# EAGLE design usb (EAGLE 7.7.0)
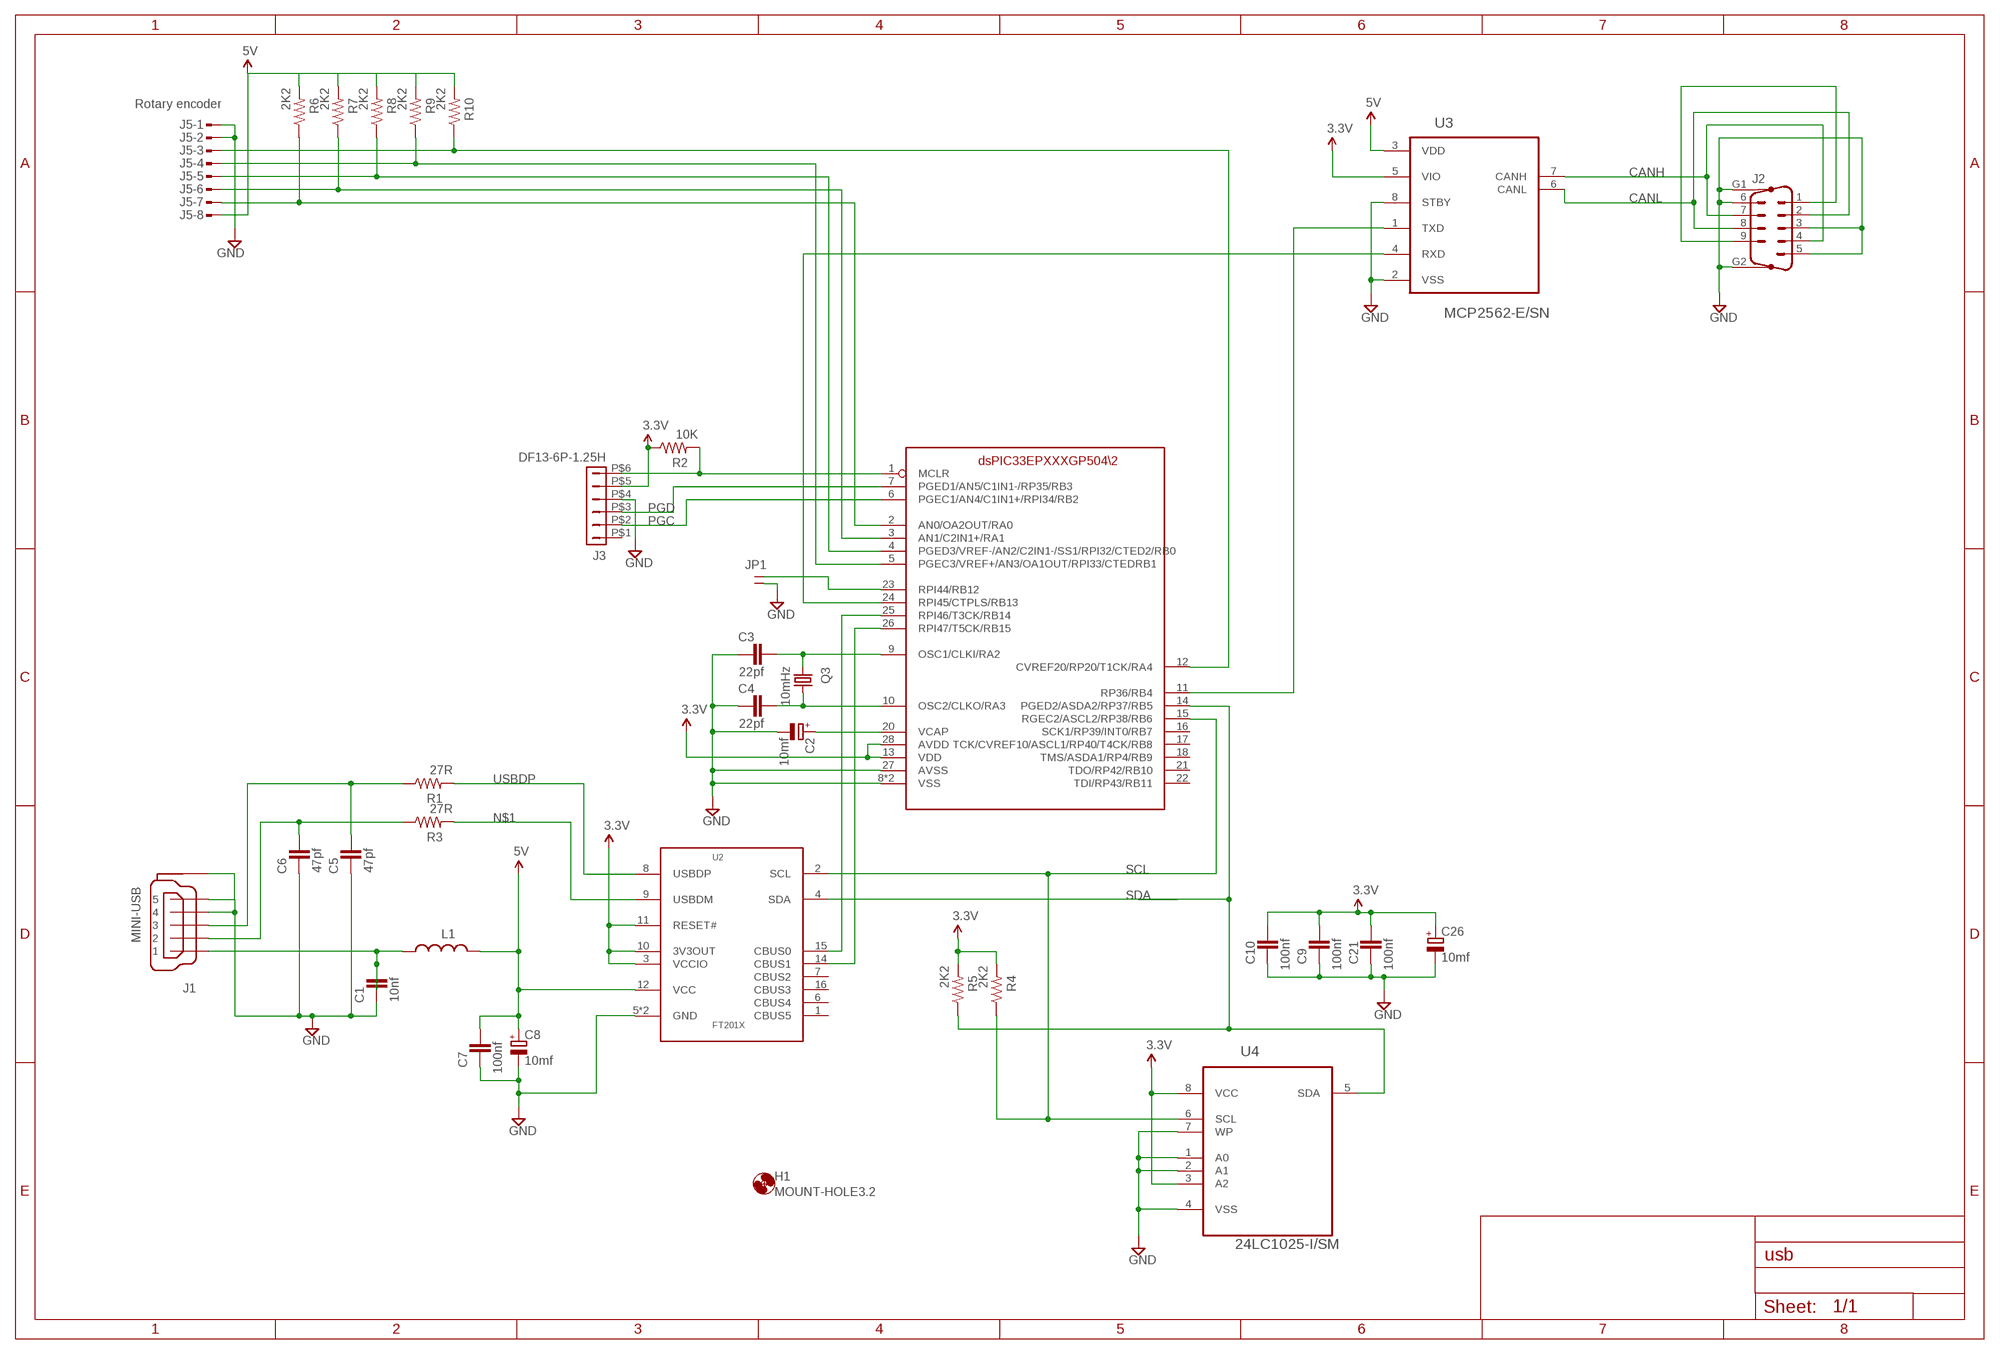
[diagram p0: schematic, sheet 1]

## Parts
C1  10nf  CAPACITOR_NPOL-0805  [C805]
C2  10mf  CAPACITOR_POL-SMC_A  [SMC_A]
C3  22pf  CAPACITOR_NPOL-0805  [C805]
C4  22pf  CAPACITOR_NPOL-0805  [C805]
C5  47pf  CAPACITOR_NPOL-0805  [C805]
C6  47pf  CAPACITOR_NPOL-0805  [C805]
C7  100nf  CAPACITOR_NPOL-0805  [C805]
C8  10mf  CAPACITOR_POL-SMC_A  [SMC_A]
C9  100nf  CAPACITOR_NPOL-0805  [C805]
C10  100nf  CAPACITOR_NPOL-0805  [C805]
C21  100nf  CAPACITOR_NPOL-0805  [C805]
C26  10mf  CAPACITOR_POL-SMC_A  [SMC_A]
H1  MOUNT-HOLE3.2  [3,2]
J1  MINI-USB  [MINI-USB]
J2  M09HP  [M09HP]
J3  DF13-6P-1.25H  [DF13A-6P-1.25H]
J5  MTOP-8  [MTOP-8]
JP1  JUMPER-1X2  [JUMPER-1X2]
L1  FERRITE-0603  [FB603]
Q3  10mHz  CRYSTALHC49S  [HC49/S]
R1  27R  RESISTOR0603-RES  [0603-RES]
R2  10K  RESISTOR0603-RES  [0603-RES]
R3  27R  RESISTOR0603-RES  [0603-RES]
R4  2K2  RESISTOR0603-RES  [0603-RES]
R5  2K2  RESISTOR0603-RES  [0603-RES]
R6  2K2  RESISTOR0603-RES  [0603-RES]
R7  2K2  RESISTOR0603-RES  [0603-RES]
R8  2K2  RESISTOR0603-RES  [0603-RES]
R9  2K2  RESISTOR0603-RES  [0603-RES]
R10  2K2  RESISTOR0603-RES  [0603-RES]
U1  DSPIC33EPXXXGP502  [SOIC-28]
U2  FT201X  [TSSOP-16]
U3  MCP2562-E/SN  [SOIC-8N]
U4  24LC1025-I/SM  [SOIC8-N_MC]

## Nets
3.3V: C9.1 C10.1 C21.1 C26.+ J3.P$5 R2.1 R4.2 R5.2 U1.13(VDD) U1.28(AVDD) U2.3(VCCIO) U2.10(3V3OUT) U2.11(RESET#) U3.5(VIO) U4.3(A2) U4.8(VCC)
5V: C7.1 C8.+ J5.8 L1.2 R6.2 R7.2 R8.2 R9.2 R10.2 U2.12(VCC) U3.3(VDD)
!MCLR: J3.P$6 R2.2 U1.1(MCLR)
+12V: J2.1 J2.9
A+: J5.7 R6.1 U1.2(AN0/OA2OUT/RA0)
A-: J5.6 R7.1 U1.3(AN1/C2IN1+/RA1)
B+: J5.5 R8.1 U1.4(PGED3/VREF-/AN2/C2IN1-/SS1/RPI32/CTED2/RB0)
B-: J5.4 R9.1 U1.5(PGEC3/VREF+/AN3/OA1OUT/RPI33/CTEDRB1)
CANH: J2.4 J2.7 U3.7(CANH)
CANL: J2.2 J2.8 U3.6(CANL)
GND: C1.2 C2.- C3.2 C4.2 C5.2 C6.2 C7.2 C8.- C9.2 C10.2 C21.2 C26.- J1.4 J1.5 J1.M1(MOUNT) J1.M2(MOUNT) J1.M3(MOUNT) J1.M4(MOUNT) J2.3 J2.5 J2.6 J2.G1 J2.G2 J3.P$4 J5.1 J5.2 JP1.2 U1.8(VSS) U1.19(VSS) U1.27(AVSS) U2.5(GND) U2.13(GND) U3.2(VSS) U3.8(STBY) U4.1(A0) U4.2(A1) U4.4(VSS) U4.7(WP)
N$1: R3.2 U2.9(USBDM)
N$2: U1.25(RPI46/T3CK/RB14) U2.15(CBUS0)
N$3: U1.24(RPI45/CTPLS/RB13) U3.4(RXD)
N$4: C2.+ U1.20(VCAP)
N$5: C3.1 Q3.2 U1.9(OSC1/CLKI/RA2)
N$6: U1.11(RP36/RB4) U3.1(TXD)
N$7: U1.26(RPI47/T5CK/RB15) U2.14(CBUS1)
N$9: C6.1 J1.2 R3.1
N$10: C1.1 J1.1 L1.1
N$14: C5.1 J1.3 R1.1
N$25: JP1.1 U1.23(RPI44/RB12)
N$70: C4.1 Q3.1 U1.10(OSC2/CLKO/RA3)
PGC: J3.P$2 U1.6(PGEC1/AN4/C1IN1+/RPI34/RB2)
PGD: J3.P$3 U1.7(PGED1/AN5/C1IN1-/RP35/RB3)
SCL: R4.1 U1.15(RGEC2/ASCL2/RP38/RB6) U2.2(SCL) U4.6(SCL)
SDA: R5.1 U1.14(PGED2/ASDA2/RP37/RB5) U2.4(SDA) U4.5(SDA)
SW1: J5.3 R10.1 U1.12(CVREF20/RP20/T1CK/RA4)
USBDP: R1.2 U2.8(USBDP)
Unconnected: J3.P$1 U1.16(SCK1/RP39/INT0/RB7) U1.17(TCK/CVREF10/ASCL1/RP40/T4CK/RB8) U1.18(TMS/ASDA1/RP4/RB9) U1.21(TDO/RP42/RB10) U1.22(TDI/RP43/RB11) U2.1(CBUS5) U2.6(CBUS4) U2.7(CBUS2) U2.16(CBUS3)

## Notes on the sheet
- Rotary encoder

## Library data of the parts
C1 C3-C7 C9 C10 C21 = dp_devices:CAPACITOR_NPOL: Non-Polarized capacitor in various packages
C2 C8 C26 = dp_devices:CAPACITOR_POL: Polarized capacitor in various packages
H1 = holes:MOUNT-HOLE: MOUNTING HOLE with drill center marker
J1 = kotuku:MINI-USB
J2 = con-subd:M09HP: SUB-D; OC_FARNELL: unknown; OC_NEWARK: unknown
J3 = con-hirose-df13:DF13-6P-1.25: DF13-6P 1.25mm Pitch Miniature Crimping Connector.
J5 = con-amp:MTOP-8: AMP connector; PARTNO: 7-215079-8
JP1 = QuantumOptics:JUMPER-1X2: Jumper, header, SIP on 0.1" grid, for option selection.
L1 = kotuku:FERRITE: Ferrite bead in various packages
Q3 = crystal:CRYSTAL: CRYSTAL; OC_FARNELL: 1667008; OC_NEWARK: unknown; PARTNO: 9B-10.000MBBK-B
R1-R5 = SparkFun-Passives:RESISTOR: Resistor Basic schematic elements and footprints for 0603, 1206, and PTH resistors.; PARTNO: ERJ-3GEYJ103V
R6-R10 = SparkFun-Passives:RESISTOR: Resistor Basic schematic elements and footprints for 0603, 1206, and PTH resistors.; PARTNO: RC0603FR-072K2L
U1 = kotuku:DSPIC33EPXXXGP502
U2 = kotuku:FT201X
U3 = Microchip-MCP2562-E_SN:MCP2562-E/SN: High-Speed CAN Transceiver,SOIC-8
U4 = Microchip_By_element14_Batch_1:24LC1025-I/SM: 1024K I2C CMOS Serial EEPROM

## Board
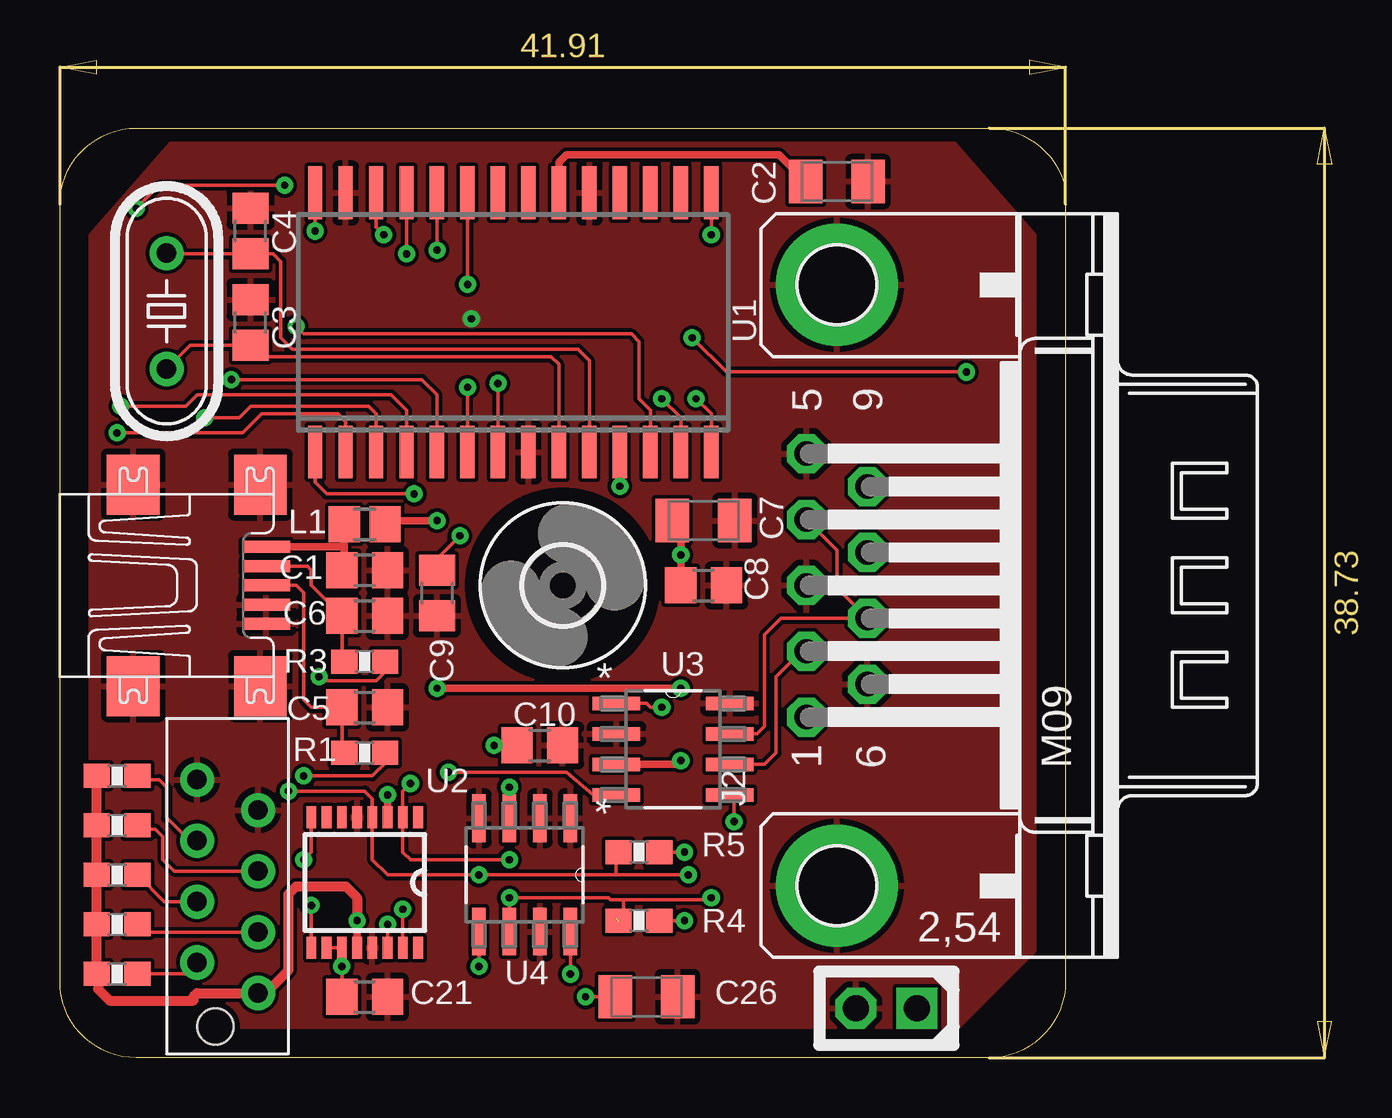
[diagram p1: board, top side]
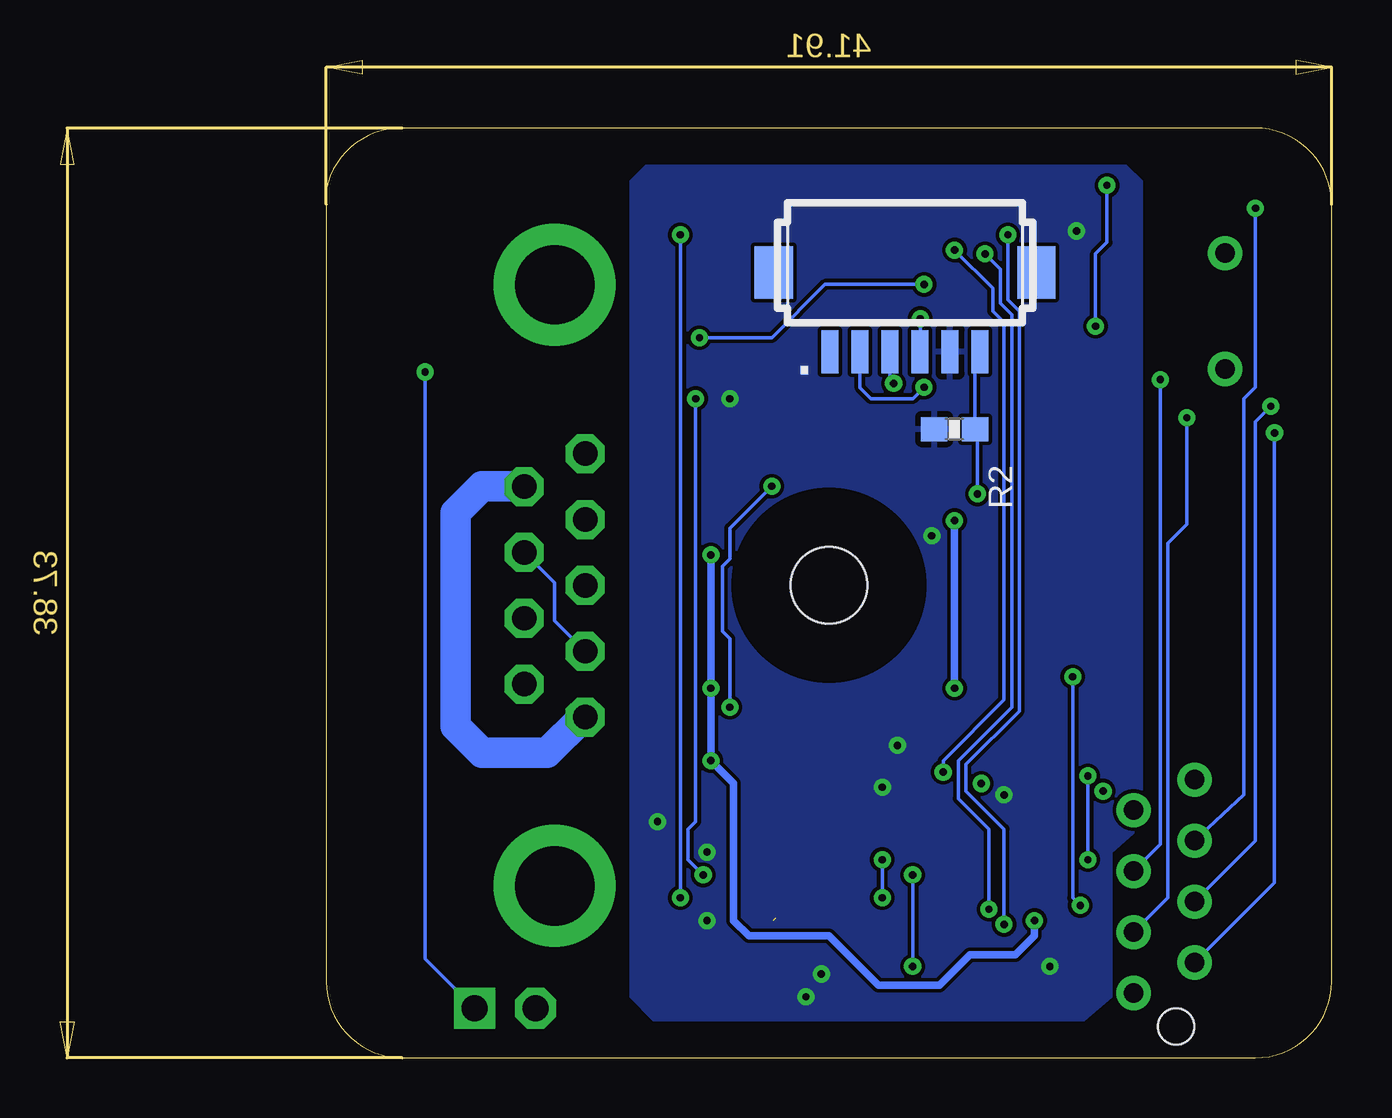
[diagram p2: board, bottom side, seen from below]

Size 41.91 x 38.73 mm. Coordinates in mm from the lower left corner, seen from the top.
Outline: 0,3.17 0,35.56 arc-90 3.17,38.73 38.73,38.73 arc-79 41.91,36.2 41.91,3.17 arc-90 38.73,0 3.17,0 arc-90 0,3.17
Copper layers (1*16): Top 0.035mm / dielectric 1.5mm / Bottom 0.035mm
Design rules "DesignRules": minimum track width 6mil, minimum drill 12mil, track to track 6mil, track to pad 6mil, pad to pad 6mil, via to via 6mil, smd to smd 0mil, copper to edge 10mil, drill to drill 10mil, minimum pad ring 12mil, minimum via ring 8mil, stop-mask expansion 2mil, vias tented up to drill 25mil, thermal gap 10mil

### Footprints (pad centres in the part's own frame; a part is rotated, then mirrored left to right if it is on the bottom)
C805 = smd 1.3 x 1.5: 1 -0.95,0; 2 0.95,0
SMC_A = smd 1.4 x 1.8: + -1.3,0; - 1.3,0
3,2 = hole 3.2: 0,0
MINI-USB = smd 2 x 0.5: 1 3.52,1.6; 2 3.52,0.8; 3 3.52,0; 4 3.52,-0.8; 5 3.52,-1.6 | smd 2.2 x 2.5: M1 -2.03,-4.2; M2 -2.03,4.2; M3 3.27,4.2; M4 3.27,-4.2
M09HP = drill 1.016 octagon: 1 -5.486,1.27; 2 -2.743,1.27; 3 0,1.27; 4 2.743,1.27; 5 5.486,1.27; 6 -4.115,-1.27; 7 -1.372,-1.27; 8 1.372,-1.27; 9 4.115,-1.27 | drill 3.302 pad 5.08: G1 -12.522,0; G2 12.522,0
DF13A-6P-1.25H = smd 1.6 x 2.2: M$0 -5.475,2.4; M$1 5.475,2.4 | smd 0.7 x 1.8: P$1 -3.125,-0.9; P$2 -1.875,-0.9; P$3 -0.625,-0.9; P$4 0.625,-0.9; P$5 1.875,-0.9; P$6 3.125,-0.9
MTOP-8 = drill 0.813: 1 4.445,1.27; 2 3.175,-1.27; 3 1.905,1.27; 4 0.635,-1.27; 5 -0.635,1.27; 6 -1.905,-1.27; 7 -3.175,1.27; 8 -4.445,-1.27 | hole 1.5: -5.842,0.508
JUMPER-1X2 = drill 1.092 square: 1 0,2.54 | drill 1.092 octagon: 2 0,0
FB603 = smd 1.3 x 1.5: 1 -0.85,0; 2 0.85,0
HC49/S = drill 0.813: 1 -2.413,0; 2 2.413,0
0603-RES = smd 1.1 x 1: 1 -0.85,0; 2 0.85,0
SOIC-28 = smd 0.6 x 2.2: 1 -8.255,-5.4; 2 -6.985,-5.4; 3 -5.715,-5.4; 4 -4.445,-5.4; 5 -3.175,-5.4; 6 -1.905,-5.4; 7 -0.635,-5.4; 8 0.635,-5.4; 9 1.905,-5.4; 10 3.175,-5.4; 11 4.445,-5.4; 12 5.715,-5.4; 13 6.985,-5.4; 14 8.255,-5.4; 15 8.255,5.4; 16 6.985,5.4; 17 5.715,5.4; 18 4.445,5.4; 19 3.175,5.4; 20 1.905,5.4; 21 0.635,5.4; 22 -0.635,5.4; 23 -1.905,5.4; 24 -3.175,5.4; 25 -4.445,5.4; 26 -5.715,5.4; 27 -6.985,5.4; 28 -8.255,5.4
TSSOP-16 = smd 0.914 x 0.406: 1 -2.718,2.223; 2 -2.718,1.587; 3 -2.718,0.953; 4 -2.718,0.318; 5 -2.718,-0.318; 6 -2.718,-0.953; 7 -2.718,-1.587; 8 -2.718,-2.223; 9 2.718,-2.223; 10 2.718,-1.587; 11 2.718,-0.953; 12 2.718,-0.318; 13 2.718,0.318; 14 2.718,0.953; 15 2.718,1.587; 16 2.718,2.223
SOIC-8N = smd 1.981 x 0.559: 1 1.448,5.715; 2 1.448,4.445; 3 1.448,3.175; 4 1.448,1.905; 5 6.172,1.905; 6 6.172,3.175; 7 6.172,4.445; 8 6.172,5.715
SOIC8-N_MC = smd 1.981 x 0.559: 1 -2.362,1.905; 2 -2.362,0.635; 3 -2.362,-0.635; 4 -2.362,-1.905; 5 2.362,-1.905; 6 2.362,-0.635; 7 2.362,0.635; 8 2.362,1.905

### Placement (x,y rotation side)
C1  12.7,20.32 0 top
C2  32.38,36.51 0 top
C3  7.94,30.64 90 top
C4  7.94,34.45 90 top
C5  12.7,14.61 0 top
C6  12.7,18.41 0 top
C7  26.83,19.68 0 top
C8  26.83,22.38 0 top
C9  15.72,19.37 270 top
C10  20,13.02 0 top
C21  12.7,2.54 0 top
C26  24.45,2.54 0 top
H1  20.95,19.68 0 top
J1  5.08,19.68 0 top
J2  32.38,19.68 90 top
J3  17.78,30.32 0 bottom
J5  6.99,7.14 90 top
JP1  33.18,2.06 270 top
L1  12.7,22.23 0 top
Q3  4.45,31.11 270 top
R1  12.7,12.7 0 top
R2  15.72,26.19 0 bottom
R3  12.7,16.51 0 top
R4  24.13,5.71 0 top
R5  24.13,8.57 0 top
R6  2.38,3.49 180 top
R7  2.38,5.56 180 top
R8  2.38,7.62 180 top
R9  2.38,9.68 180 top
R10  2.38,11.75 180 top
U1  18.89,30.64 0 top
U2  12.7,7.3 270 top
U3  21.75,9.05 0 top
U4  19.37,7.62 270 top

### Tracks (layer width: path | path; a pad name or v marks a point on that pad's centre or on a via)
3.3V  (via drill 0.3, 0.3 pad 0.41)
  Top 0.152: U4.8 v21.27,3.49 | C26.+ v21.91,2.54 | R4.2 v26.04,5.71 | R5.2 v26.04,8.57 | U2.11 C21.1 | U2.10 U2.11 | U3.5 28.1,10.78 v28.1,9.84 | C10.1 v18.1,13.02 | U4.3 v18.73,11.27 | U1.28 v10.64,34.45 | U1.13 25.88,26.67 v25.08,27.46 | C9.1 15.72,20.8 v16.67,21.75 | v11.75,3.81 U2.11
  Top 0.305: U2.3 v13.65,10.95
  pour Bottom: 7.94,36.51 8.57,37.15 28.57,37.15 29.21,36.51 29.21,2.54 28.26,1.59 10.32,1.59 9.21,2.54 9.21,8.57 7.94,9.68
5V  (via drill 0.3, 0.3 pad 0.41)
  Top 0.305: U2.12 v12.38,5.71 | L1.2 13.71,22.38 v15.72,22.38 | v15.72,15.4 v25.88,15.4 | v25.88,12.38 25.72,12.22 U3.3 | C7.1 v25.88,20.95 25.88,22.04 C8.+
  Top 0.406: v12.38,5.71 12.38,6.67 11.91,7.14 9.84,7.14 9.53,6.83 9.53,3.65 8.57,2.7 J5.8 5.71,2.7 5.56,2.54 5.56,2.38 2.06,2.38 1.59,2.86 1.59,3.49 R6.2 R7.2 R8.2 R9.2 R10.2
  Bottom 0.305: v15.72,22.38 v15.72,15.4 | v25.88,20.95 v25.88,15.4 v25.88,12.38 24.92,11.43 24.92,5.71 24.29,5.08 20.95,5.08 18.89,3.02 16.35,3.02 15.08,4.29 13.18,4.29 12.38,5.08 v12.38,5.71
!MCLR  (via drill 0.3)
  Top 0.152: U1.1 10.64,23.97 11.11,23.5 v14.76,23.5
  Bottom 0.152: v14.76,23.5 14.76,26.09 R2.2 14.87,29.21 J3.P$6
+12V
  Bottom 1.27: J2.1 31.2,14.2 32.7,12.7 35.4,12.7 36.51,13.81 36.51,22.7 35.4,23.81 33.67,23.81 J2.9
A+  (via drill 0.3)
  Top 0.152: R6.1 5.24,3.49 J5.7 | U1.2 11.91,26.51 11.59,26.83 8.41,26.83 7.62,26.04 v2.38,26.04
  Bottom 0.152: J5.7 2.38,7.3 v2.38,26.04
A-  (via drill 0.3)
  Top 0.152: R7.1 3.55,5.24 J5.6 | U1.3 13.18,26.83 12.86,27.15 7.94,27.15 7.46,26.67 v6.03,26.67
  Bottom 0.152: J5.6 6.83,6.67 6.83,21.43 6.03,22.23 v6.03,26.67
B+  (via drill 0.3)
  Top 0.152: R8.1 4.34,6.51 J5.5 | U1.4 14.45,26.99 13.81,27.62 5.71,27.62 5.24,27.15 v2.54,27.15
  Bottom 0.152: J5.5 3.17,9.05 3.17,26.51 v2.54,27.15
B-  (via drill 0.3)
  Top 0.152: R9.1 3.39,9.53 3.97,9.53 4.29,9.21 4.29,8.26 4.76,7.78 J5.4 | U1.5 15.72,27.62 15.08,28.26 v7.14,28.26
  Bottom 0.152: J5.4 7.14,8.89 v7.14,28.26
CANH
  Top 0.152: U3.7 29.05,13.49 29.37,13.81 29.37,17.62 30.06,18.31 J2.7 32.38,19.58 32.38,21.16 J2.4
CANL
  Top 0.152: U3.6 29.37,12.22 29.84,12.7 29.84,15.88 30.91,16.94 J2.2
  Bottom 0.152: J2.2 32.38,18.21 32.38,19.79 J2.8
GND  (via drill 0.3)
  Bottom 0.152: J3.P$4 17.14,29.43 v17.14,30.8
  pour Top: 1.27,4.45 1.27,34.29 4.6,38.1 37.31,38.1 40.64,34.29 40.64,4.45 37.47,1.27 4.76,1.27
N$1  (via drill 0.3 pad 0.41)
  Top 0.152: R3.2 13.55,16.09 13.18,15.72 11.11,15.72 v10.79,15.88 | v10.48,6.35 U2.9
  Bottom 0.152: v10.79,15.88 10.79,6.67 v10.48,6.35
N$2  (via drill 0.3)
  Top 0.152: v14.29,6.19 U2.15 | v14.45,33.5 U1.25
  Bottom 0.152: v14.29,6.19 14.29,9.53 15.56,10.79 15.56,12.38 13.34,14.61 13.34,30.96 13.81,31.43 13.81,32.86 v14.45,33.5
N$3  (via drill 0.3)
  Top 0.152: U3.4 22.23,10.95 21.11,11.91 v16.19,11.91 | v15.72,33.66 U1.24
  Bottom 0.152: v16.19,11.91 16.19,12.38 13.65,14.92 13.65,30.64 14.13,31.11 14.13,32.07 v15.72,33.66
N$4
  Top 0.305: U1.20 20.8,37.31 21.11,37.62 29.97,37.62 C2.+
N$5
  Top 0.152: Q3.2 5.43,29.69 C3.1 8.41,29.21 20.48,29.21 20.8,28.89 U1.9
N$6  (via drill 0.3)
  Top 0.152: U3.1 24.45,14.76 24.61,14.61 v25.08,14.61 | v23.34,23.81 U1.11
  Bottom 0.152: v25.08,14.61 25.08,17.46 25.4,17.78 25.4,20.48 25.08,20.8 25.08,22.07 v23.34,23.81
N$7  (via drill 0.3)
  Top 0.152: U2.14 v13.65,5.56 | v13.49,34.29 13.18,34.61 U1.26
  Bottom 0.152: v13.65,5.56 13.65,9.53 15.24,11.11 15.24,12.22 13.02,14.45 13.02,31.11 13.49,31.59 v13.49,34.29
N$9
  Top 0.152: R3.1 11.75,16.61 C6.1 10.48,19.68 10.48,20.32 10.31,20.48 J1.2
N$10
  Top 0.305: C1.1 11.85,20.32 11.85,21.29 | J1.1 11.85,21.29 | L1.1 11.85,21.29
N$14
  Top 0.152: R1.1 11.75,12.8 C5.1 10.48,14.61 10.16,14.92 10.16,19.37 9.84,19.68 J1.3
N$25  (via drill 0.3)
  Top 0.152: U1.23 v16.99,32.23 | v26.35,30 27.78,28.57 v37.78,28.57
  Bottom 0.152: v16.99,32.23 21.11,32.23 23.34,30 v26.35,30 | v37.78,28.57 37.78,4.13 JP1.1
N$70
  Top 0.152: Q3.1 4.47,33.5 C4.1 8.89,33.5 9.21,33.18 9.21,30 9.68,29.53 21.59,29.53 22.07,29.05 U1.10
PGC  (via drill 0.3)
  Top 0.152: U1.6 v16.99,27.94
  Bottom 0.152: v16.99,27.94 17.46,27.46 19.21,27.46 19.66,27.91 J3.P$2
PGD  (via drill 0.3)
  Top 0.152: U1.7 v18.26,28.1
  Bottom 0.152: v18.26,28.1 18.41,28.25 J3.P$3
SCL  (via drill 0.3, 0.3 pad 0.41)  (1 unrouted)
  Top 0.152: U4.6 v18.73,6.67 22.86,6.67 22.94,6.59 23.5,6.59 | v18.73,8.26 14.61,8.26 14.29,8.57 U2.2 14.29,11.11 v14.61,11.43 | U1.15 v27.15,34.29 | v27.15,6.67 27.07,6.59 23.5,6.59 | 23.18,5.82 23.5,6.13 23.5,6.59
  Bottom 0.152: v18.73,6.67 v18.73,8.26 | v27.15,34.29 v27.15,6.67
SDA  (via drill 0.3, 0.3 pad 0.41)
  Top 0.152: v17.46,3.81 U4.5 | 23.18,7.62 v17.46,7.62 13.65,7.62 13.02,8.26 U2.4 13.02,10.79 12.7,11.11 v9.53,11.11 | 23.18,7.62 v26.19,7.62 | U1.14 27.15,26.83 v26.51,27.46 | R5.1 23.18,8.47 23.18,7.62
  Bottom 0.152: v17.46,7.62 v17.46,3.81 | v26.51,27.46 26.51,9.84 26.83,9.53 26.83,8.26 v26.19,7.62
SW1  (via drill 0.3)
  Top 0.152: R10.1 3.39,11.59 4.13,11.59 4.45,11.27 4.45,10 5.4,9.05 J5.3 | U1.12 24.61,26.99 24.13,27.46 24.13,29.84 23.81,30.16 10.16,30.16 v9.84,30.48 | v9.37,36.35 4.13,36.35 v3.17,35.4
  Bottom 0.152: v9.84,30.48 9.84,33.5 9.37,33.97 v9.37,36.35 | v3.17,35.4 3.17,27.94 3.65,27.46 3.65,10.95 J5.3
USBDP  (via drill 0.3 pad 0.41)
  Top 0.152: R1.2 13.55,12.28 13.02,11.75 v10.16,11.75 | v10.16,8.26 10.48,8.57 U2.8
  Bottom 0.152: v10.16,11.75 v10.16,8.26